# EAGLE schematic lm5175_smps_v0002 (EAGLE 6.4)
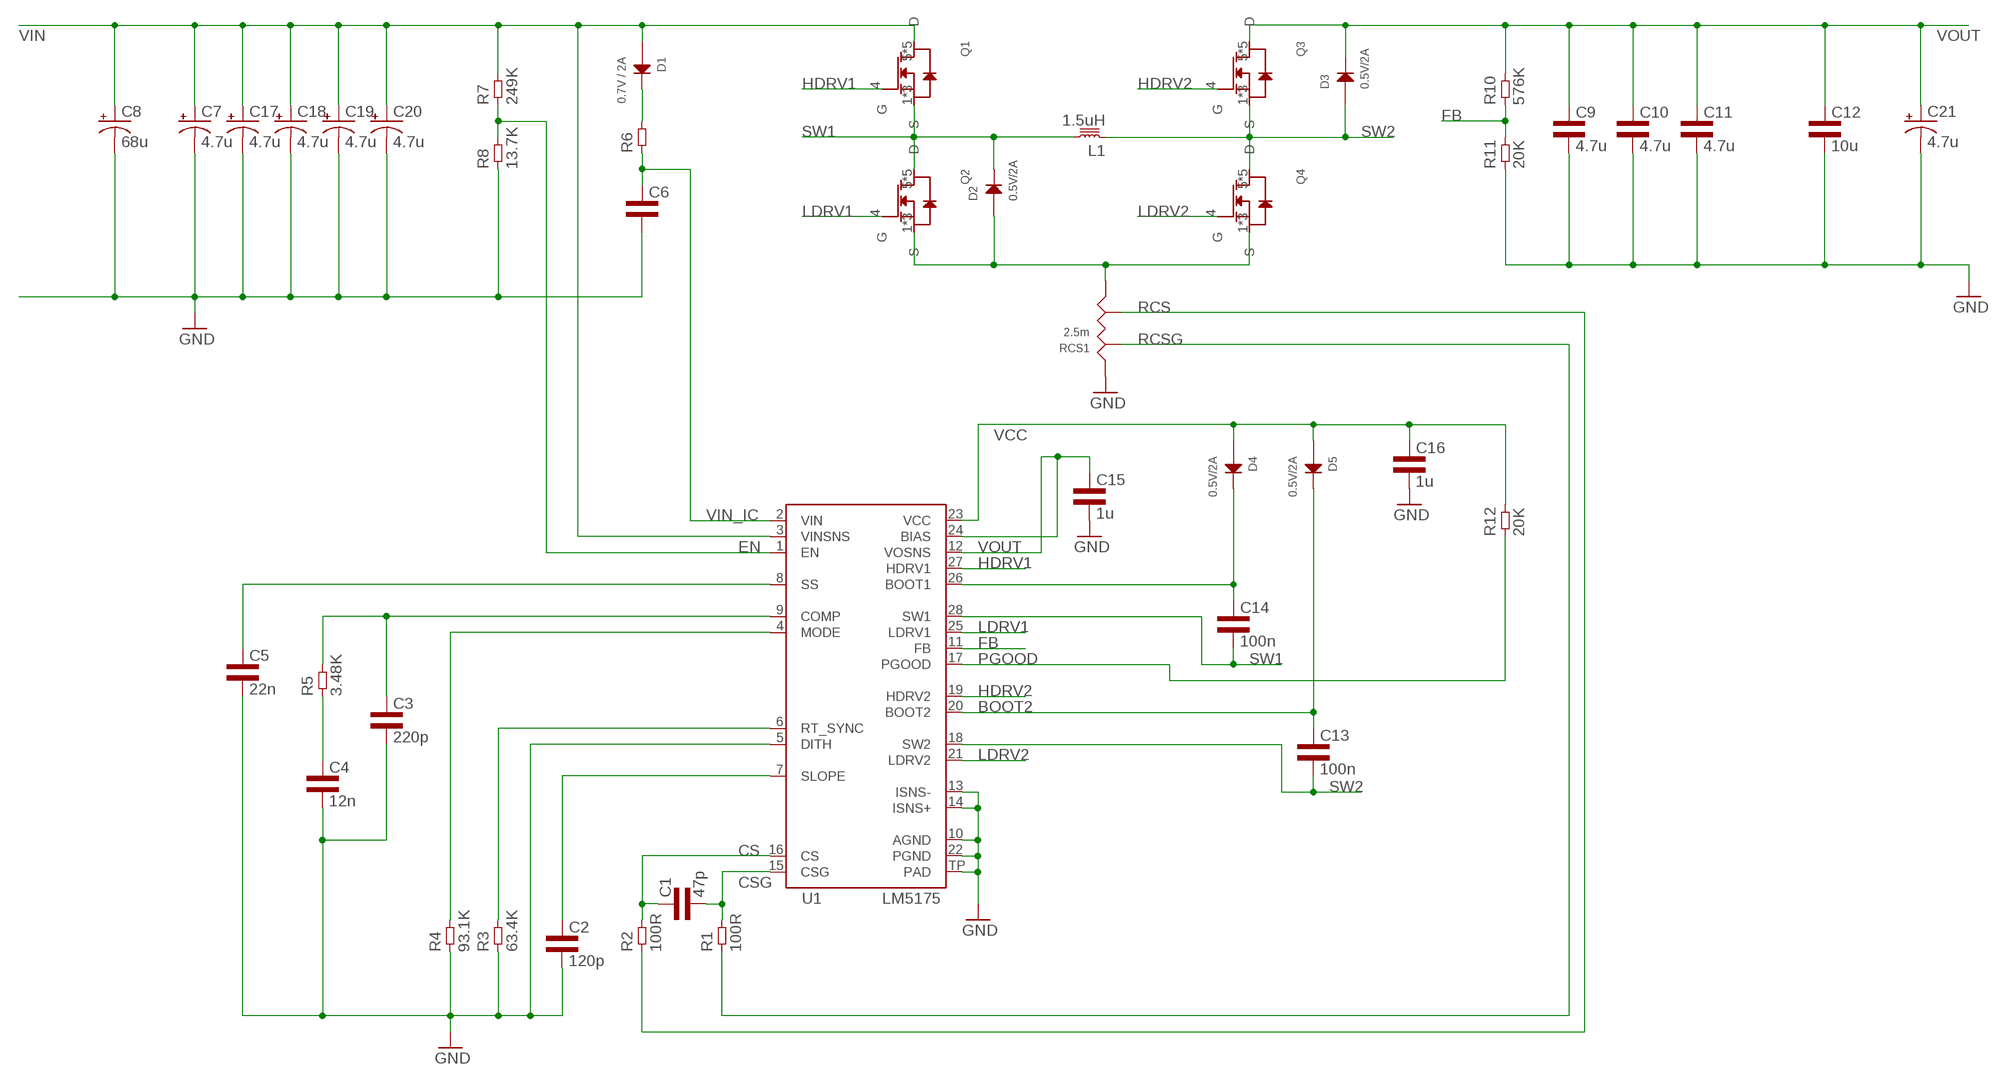
[diagram p0: schematic, sheet 1]

## Parts
C1  47p  CAP0402L3  [0402L3]
C2  120p  CAP0603L3  [0603L3]
C3  220p  CAP0603L3  [0603L3]
C4  12n  CAP0603L3  [0603L3]
C5  22n  CAP0603L3  [0603L3]
C6  CAP0603L3  [0603L3]
C7  4.7u  CPOL-USSANYO_SMD_E12  [SANYO-OSCON_SMD_E12]
C8  68u  CPOL-US153CLV-0810  [153CLV-0810]
C9  4.7u  CAP1206L3  [1206L3]
C10  4.7u  CAP1206L3  [1206L3]
C11  4.7u  CAP1206L3  [1206L3]
C12  10u  CAP1206L3  [1206L3]
C13  100n  CAP0603L3  [0603L3]
C14  100n  CAP0603L3  [0603L3]
C15  1u  CAP0603L3  [0603L3]
C16  1u  CAP0603L3  [0603L3]
C17  4.7u  CPOL-USSANYO_SMD_E12  [SANYO-OSCON_SMD_E12]
C18  4.7u  CPOL-USSANYO_SMD_E12  [SANYO-OSCON_SMD_E12]
C19  4.7u  CPOL-USSANYO_SMD_E12  [SANYO-OSCON_SMD_E12]
C20  4.7u  CPOL-USSANYO_SMD_E12  [SANYO-OSCON_SMD_E12]
C21  4.7u  CPOL-USSANYO_SMD_E12  [SANYO-OSCON_SMD_E12]
D1  0.7V / 2A  DIODESMA  [SMA-2]
D2  0.5V/2A  DIODESMA  [SMA-2]
D3  0.5V/2A  DIODESMA  [SMA-2]
D4  0.5V/2A  DIODESMA  [SMA-2]
D5  0.5V/2A  DIODESMA  [SMA-2]
L1  1.5uH  INDUCTOR5752  [5.7X5.2]
Q1  CSD18540Q5B  [Q5B]
Q2  CSD18540Q5B  [Q5B]
Q3  CSD18540Q5B  [Q5B]
Q4  CSD18540Q5B  [Q5B]
R1  100R  RES0603L3  [0603L3]
R2  100R  RES0603L3  [0603L3]
R3  63.4K  RES0603L3  [0603L3]
R4  93.1K  RES0603L3  [0603L3]
R5  3.48K  RES0603L3  [0603L3]
R6  RES0603L3  [0603L3]
R7  249K  RES0603L3  [0603L3]
R8  13.7K  RES0603L3  [0603L3]
R10  576K  RES0603L3  [0603L3]
R11  20K  RES0603L3  [0603L3]
R12  20K  RES0603L3  [0603L3]
RCS1  2.5m  CSRES  [R2512]
U1  LM5175  [R-PDSO-G28]

## Nets
BOOT2: C13.P$1 D5.2(CATHODE) U1.20(BOOT2)
CS: C1.P$1 R2.P$2 U1.16(CS)
CSG: C1.P$2 R1.P$2 U1.15(CSG)
EN: R7.P$1 R8.P$2 U1.1(EN)
FB: R10.P$1 R11.P$2 U1.11(FB)
GND: C2.P$2 C3.P$2 C4.P$2 C5.P$2 C6.P$2 C7.- C8.- C9.2 C10.2 C11.2 C12.2 C15.P$2 C16.P$2 C17.- C18.- C19.- C20.- C21.- R3.P$1 R4.P$1 R8.P$1 R11.P$1 RCS1.1_1 RCS1.1_2 U1.5(DITH) U1.10(AGND) U1.13(ISNS-) U1.14(ISNS+) U1.22(PGND) U1.TP(PAD)
HDRV1: Q1.4(G) U1.27(HDRV1)
HDRV2: Q3.4(G) U1.19(HDRV2)
LDRV1: Q2.4(G) U1.25(LDRV1)
LDRV2: Q4.4(G) U1.21(LDRV2)
N$3: C2.P$1 U1.7(SLOPE)
N$5: R3.P$2 U1.6(RT_SYNC)
N$6: R4.P$2 U1.4(MODE)
N$7: C4.P$1 R5.P$1
N$8: C3.P$1 R5.P$2 U1.9(COMP)
N$11: C5.P$1 U1.8(SS)
N$12: D1.2(CATHODE) R6.P$2
N$20: C14.P$1 D4.2(CATHODE) U1.26(BOOT1)
PGOOD: R12.P$1 U1.17(PGOOD)
RCS: R2.P$1 RCS1.CS_2
RCSG: R1.P$1 RCS1.CS_1
SNS_HIGH: D2.1(ANODE) Q2.1(S) Q2.2(S) Q2.3(S) Q4.1(S) Q4.2(S) Q4.3(S) RCS1.2_1 RCS1.2_2
SW1: C14.P$2 D2.2(CATHODE) L1.2 Q1.1(S) Q1.2(S) Q1.3(S) Q2.5(D) Q2.6(D) Q2.7(D) Q2.8(D) Q2.9(D) U1.28(SW1)
SW2: C13.P$2 D3.1(ANODE) L1.1 Q3.1(S) Q3.2(S) Q3.3(S) Q4.5(D) Q4.6(D) Q4.7(D) Q4.8(D) Q4.9(D) U1.18(SW2)
VCC: C16.P$1 D4.1(ANODE) D5.1(ANODE) R12.P$2 U1.23(VCC)
VIN: C7.+ C8.+ C17.+ C18.+ C19.+ C20.+ D1.1(ANODE) Q1.5(D) Q1.6(D) Q1.7(D) Q1.8(D) Q1.9(D) R7.P$2 U1.3(VINSNS)
VIN_IC: C6.P$1 R6.P$1 U1.2(VIN)
VOUT: C9.1 C10.1 C11.1 C12.1 C15.P$1 C21.+ D3.2(CATHODE) Q3.5(D) Q3.6(D) Q3.7(D) Q3.8(D) Q3.9(D) R10.P$2 U1.12(VOSNS) U1.24(BIAS)

## Library data of the parts
C1-C6 C9-C16 = common:CAP
C7 C8 C17-C21 = rcl:CPOL-US: POLARIZED CAPACITOR, American symbol
D1-D5 = common:DIODE
L1 = common:INDUCTOR
Q1-Q4 = common:CSD18540Q5B: N-Channel High-Power MosFET; I_MAX: 221A; PD: 195W; PULSED_DRAIN_CURRENT: 400A; VGS: +/- 20V; V_MAX: 60V
R1-R8 R10-R12 = common:RES
RCS1 = common:CSRES: Current sense resistor with optimized footprint for sense accuracy. Vias should be place at the outer edges of the sense pads with traces connecting them. This provides an error margin of .6% to 2% as long as all other layout guidelines are followed.
U1 = common:LM5175: The LM5175 is a synchronous four-switch buck-boost 1• Single Inductor Buck-Boost Controller for Step- Up/Step-Down DC/DC Conversion DC/DC controller capable of regulating the output voltage at, above, or below the input voltage.